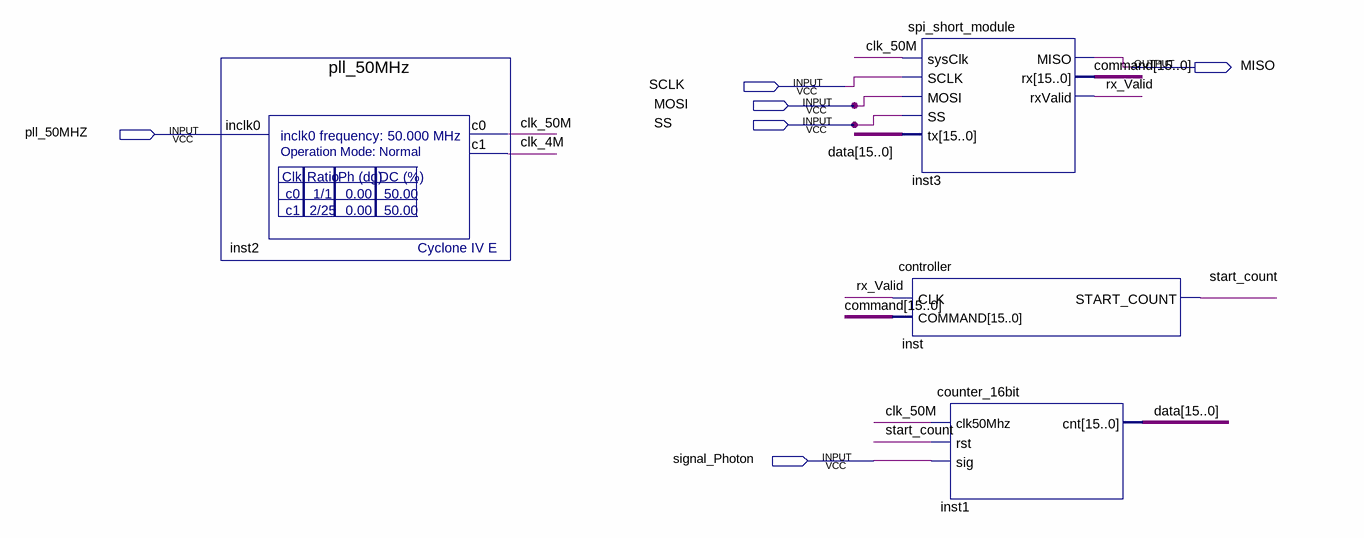
[diagram p0: schematic sheet]
// Quartus schematic counter_fpga_image_with_Arduiono.bdf as structural Verilog: 4 symbols, 6 pins
module counter_fpga_image_with_Arduiono (
  input  SCLK,
  input  MOSI,
  input  SS,
  input  pll_50MHZ,
  input  signal_Photon,
  output MISO
);

  wire clk_4M, clk_50M, rx_Valid, start_count;
  wire [15:0] command, data;

  pll_50MHz inst2 (.inclk0(pll_50MHZ), .c0(clk_50M), .c1(clk_4M));
  spi_short_module inst3 (
    .sysClk(clk_50M), .SCLK(SCLK), .MOSI(MOSI), .SS(SS), .tx(data), .MISO(MISO), .rx(command),
    .rxValid(rx_Valid));
  controller inst (.CLK(rx_Valid), .COMMAND(command), .START_COUNT(start_count));
  counter_16bit inst1 (.clk50Mhz(clk_50M), .rst(start_count), .sig(signal_Photon), .cnt(data));
endmodule
